# EAGLE design tube_power (EAGLE 6.6.0)
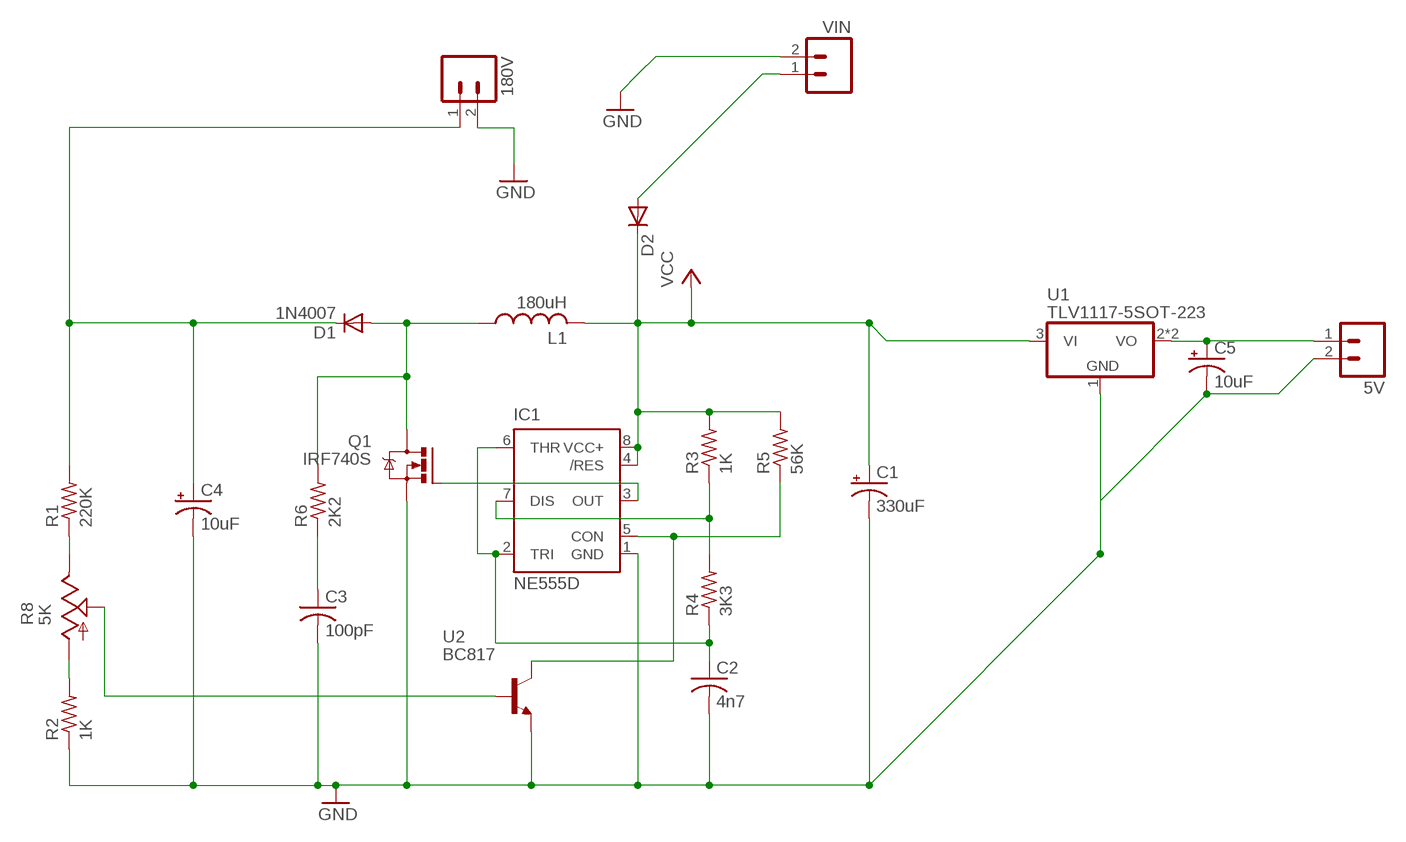
[diagram p0: schematic, sheet 1]

## Parts
5V  M023.5MM  [SCREWTERMINAL-3.5MM-2]
180V  M023.5MM  [SCREWTERMINAL-3.5MM-2]
C1  330uF  CAPACITOR_POLE5-10.5  [E5-10,5]
C2  4n7  CAPACITORC0805K  [C0805K]
C3  100pF  CAPACITORC0805K  [C0805K]
C4  10uF  CAPACITOR_POLE3.5-8  [E3,5-8]
C5  10uF  CAPACITOR_POLE2-5  [E2-5]
D1  1N4007  DIODESMA  [SMA-DIODE]
D2  DIODESOD-80  [SOD80C]
IC1  NE555D  [SO08]
L1  180uH  INDUCTOR  [RBL0712]
Q1  IRF740S  [TO263]
R1  220K  RESISTOR0207/10  [0207/10]
R2  1K  RESISTORR1206  [R1206]
R3  1K  RESISTORR0805  [R0805]
R4  3K3  RESISTORR0805  [R0805]
R5  56K  RESISTORR0805  [R0805]
R6  2K2  RESISTORR0805  [R0805]
R8  5K  TRIM_POTEVM2N  [TRIM-EVM2N]
U1  TLV1117-5SOT-223  [SOT-223]
U2  BC817  [SOT-23]
VIN  M023.5MM  [SCREWTERMINAL-3.5MM-2]

## Nets
5V [power]: 5V.1 C5.+ U1.2(VO) U1.4(VO)
180V [power]: 180V.1 C4.+ D1.C R1.2
CON: IC1.5(CON) R5.1 U2.3(C)
DIS: IC1.7(DIS) R3.1 R4.2
GND [ground]: 5V.2 180V.2 C1.- C2.2 C3.2 C4.- C5.- IC1.1(GND) Q1.2(S) R2.1 U1.1(GND) U2.2(E) VIN.2
L1: D1.A L1.P$1 Q1.3(D) R6.2
N$1: R8.P$2(S) U2.1(B)
N$2: D2.A VIN.1
N$3: R2.2 R8.P$1(A)
OUT: IC1.3(OUT) Q1.1(G)
R1: R1.1 R8.P$3(E)
R6: C3.1 R6.1
THR: C2.1 IC1.2(TRI) IC1.6(THR) R4.1
VCC: C1.+ D2.C IC1.4(/RES) IC1.8(VCC+) L1.P$2 R3.2 R5.2 U1.3(VI)

## Library data of the parts
5V 180V VIN = iStivi - Header-Connector:M02: Header 2 Standard 2-pin 0.1" header. Use with straight break away headers (SKU : PRT-00116), right angle break away headers (PRT-00553), swiss pins (PRT-00743), machine pins (PRT-00117), and female headers (PRT-00115). Molex polarized connector foot print use with SKU : PRT-08233 with associated crimp pins and housings.
C1 C4 C5 = iStivi - RCLD:CAPACITOR_POL: POLARIZED CAPACITOR, American symbol
C2 C3 = iStivi - RCLD:CAPACITOR: CAPACITOR, American symbol
D1 D2 = iStivi - RCLD:DIODE: Diode These are standard reverse protection diodes and small signal diodes.
IC1 = iStivi - ICs:NE555: Timer General purpose bipolar Timer
L1 = iStivi - RCLD:INDUCTOR: INDUCTOR
Q1 = iStivi - Transistor-FET-reg:IRF740: N-CHANNEL MOS FET 400V MOSFET
R1-R6 = iStivi - RCLD:RESISTOR: RESISTOR
R8 = iStivi - RCLD:TRIM_POT: POTENTIOMETER
U1 = iStivi - Transistor-FET-reg:TLV1117-5: Fixed 5V regulator SMD fixed 5V regulator TLV117-5
U2 = iStivi - Transistor-FET-reg:BC817: BC817 NPN Transistor NPN transistor

## Net classes
1 ground: width 0.356 mm
2 power: width 0.356 mm

## Board
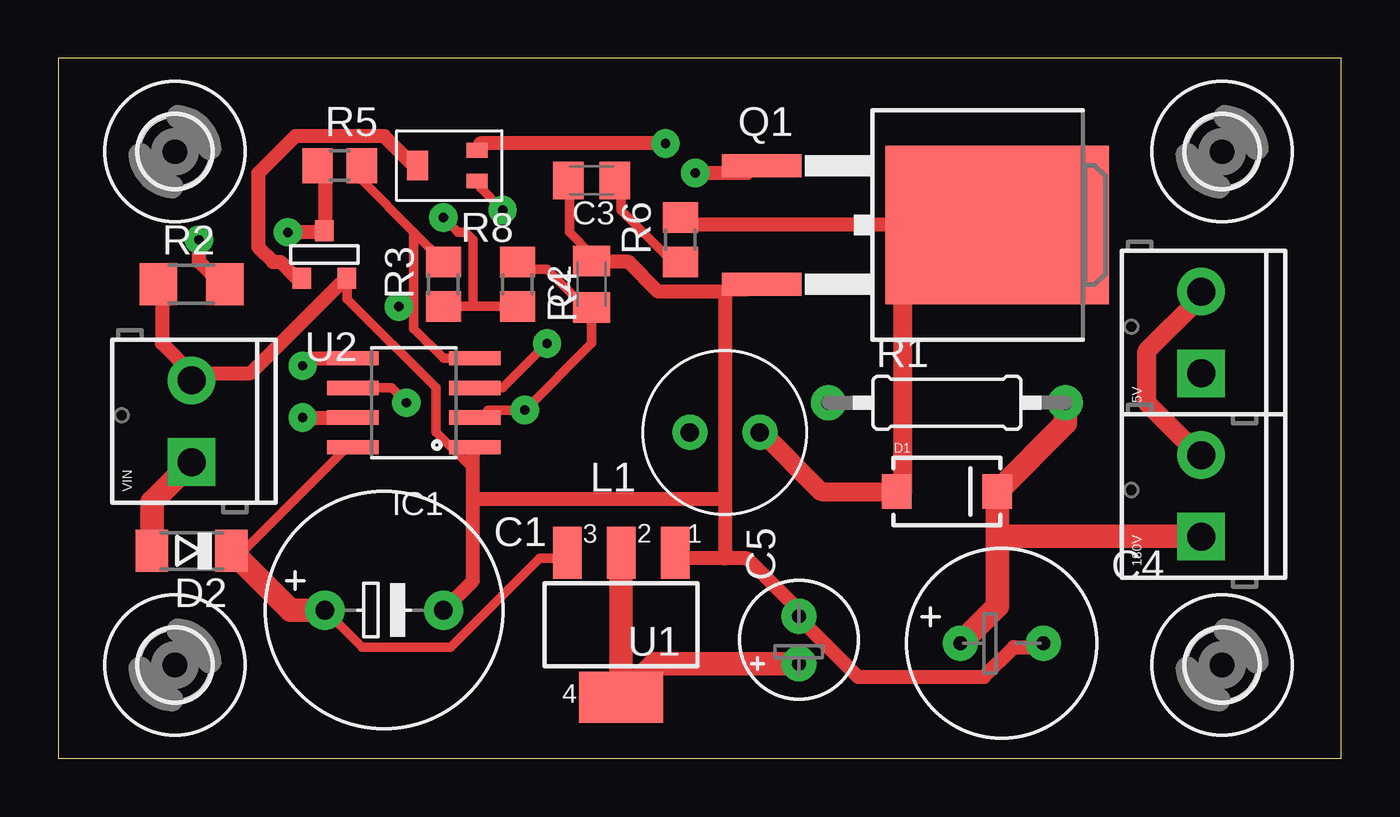
[diagram p1: board, top side]
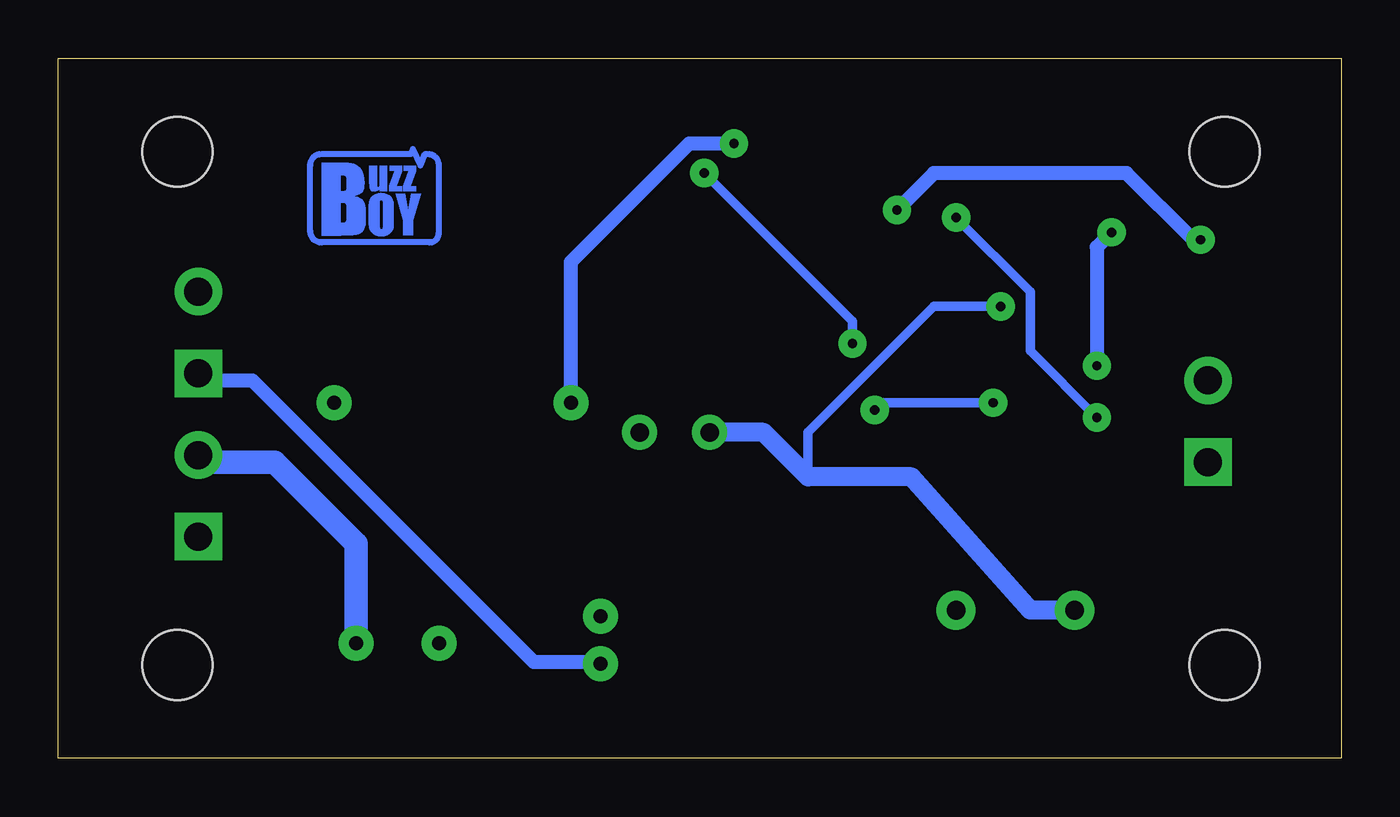
[diagram p2: board, bottom side, seen from below]

Size 55 x 30 mm. Coordinates in mm from the lower left corner, seen from the top.
Outline: 0,0 55,0 55,30 0,30 0,0
Copper layers (1*16): Top 0.035mm / dielectric 1.5mm / Bottom 0.035mm
Design rules "iStivi-0.8mm via-12mil-track *": minimum track width 16mil, minimum drill 0.4mm, track to track 12mil, track to pad 12mil, pad to pad 10mil, via to via 16mil, smd to smd 10mil, copper to edge 40mil, drill to drill 8mil, minimum pad ring 10mil, minimum via ring 16mil, stop-mask expansion 0mil, vias tented up to drill 0.4mm, thermal gap 12mil

### Footprints (pad centres in the part's own frame; a part is rotated, then mirrored left to right if it is on the bottom)
SCREWTERMINAL-3.5MM-2 = drill 1.2 pad 2.032 square: 1 0,0 | drill 1.2 pad 2.032: 2 3.5,0
E5-10,5 = drill 0.8 pad 1.676: + -2.54,0; - 2.54,0
C0805K = smd 1.3 x 1.6: 1 -1,0; 2 1,0
E3,5-8 = drill 0.6 pad 1.5: + -1.778,0; - 1.778,0
E2-5 = drill 0.6 pad 1.5: + -1.016,0; - 1.016,0
SMA-DIODE = smd 1.27 x 1.47: A -2.15,0; C 2.15,0
SOD80C = smd 1.4 x 1.8: A 1.7,0; C -1.7,0
SO08 = smd 0.61 x 2.21: 1 -1.905,-2.616; 2 -0.635,-2.616; 3 0.635,-2.616; 4 1.905,-2.616; 5 1.905,2.616; 6 0.635,2.616; 7 -0.635,2.616; 8 -1.905,2.616
RBL0712 = drill 0.8 pad 1.5: P$1 -1.5,0; P$2 1.5,0
TO263 = smd 1 x 3.4: 1 -2.54,-6.6; 2 2.54,-6.6 | smd 6.8 x 9.6: 3 0,3.5
0207/10 = drill 0.6 pad 1.5: 1 -5.08,0; 2 5.08,0
R1206 = smd 1.6 x 1.803: 1 -1.422,0; 2 1.422,0
R0805 = smd 1.3 x 1.5: 1 -0.95,0; 2 0.95,0
TRIM-EVM2N = smd 0.635 x 0.9: P$1 -0.66,-1.45; P$3 0.66,-1.45 | smd 1.27 x 0.9: P$2 0,1.1
SOT-223 = smd 1.219 x 2.235: 1 -2.311,-3.099; 2 0,-3.099; 3 2.311,-3.099 | smd 3.6 x 2.2: 4 0,3.099
SOT-23 = smd 0.787 x 0.889: 1 0.991,1.016; 2 -0.94,1.016; 3 0.025,-1.016
3,0-SMALL = hole 3: 0,0

### Placement (x,y rotation side)
5V  49,16.5 90 top
180V  49,9.5 90 top
C1  13.97,6.35 0 top
C2  22.86,20.32 90 top
C3  22.86,24.77 180 top
C4  40.44,4.93 0 top
C5  31.75,5.08 90 top
D1  38.1,11.43 0 top
D2  5.71,8.89 180 top
IC1  15.24,15.24 90 top
L1  28.57,13.97 180 top
Q1  36.75,22.86 270 top
R1  38.1,15.24 0 top
R2  5.71,20.32 0 top
R3  16.51,20.32 90 top
R4  19.68,20.32 270 top
R5  12.06,25.4 0 top
R6  26.67,22.23 90 top
R8  16.51,25.4 90 top
U1  24.13,5.71 180 top
U2  11.43,21.59 180 top
U$1  [3,0-SMALL]  5,26 0 top
U$2  [3,0-SMALL]  5,4 0 top
U$3  [BUZZBOY-SILK]  21.59,13.97 90 top
U$4  [3,0-SMALL]  49.89,4 0 top
U$5  [3,0-SMALL]  49.89,26 0 top
U$6  [BUZZBOY]  44.37,21.91 0 bottom
VIN  5.71,12.7 90 top

### Tracks (layer width: path | path; a pad name or v marks a point on that pad's centre or on a via)
5V
  Top 1.016: U1.2 U1.4 25.58,4.06 C5.+
  Bottom 0.406: 32.38,4.13 C5.+
  Bottom 0.61: 32.38,4.13 34.61,4.13 46.67,16.19 48.9,16.19 5V.1
180V
  Top 1.016: C4.+ 40.25,6.51 40.25,9.53 | 40.25,9.53 D1.C 43.18,14.36 R1.2 | 180V.1 48.98,9.53 40.25,9.53
CON  (via drill 0.4)
  Top 0.406: 11.43,22.86 U2.3 11.11,22.54 | 11.43,25.4 R5.1 | v10.48,16.83 10.79,17.14
  Top 0.61: 11.43,25.4 11.43,22.86 | 10.79,17.14 IC1.5 | 11.11,22.54 v9.84,22.54
  Bottom 0.61: v10.48,16.83 10.48,21.91 v9.84,22.54
DIS  (via drill 0.4)
  Top 0.406: 17.78,19.37 R4.2 | 17.78,19.37 R3.1 | v16.51,23.18 17.14,22.54 17.46,22.54 17.78,22.23 17.78,19.37
  Top 0.61: v10.48,14.61 IC1.7
  Bottom 0.406: v10.48,14.61 13.34,17.46 13.34,20 v16.51,23.18
GND
  Top 0.406: 12.06,20.32 U2.2 12.38,20.32 12.38,19.68 16.19,15.88 16.19,13.97 17.78,12.38 | 5.71,16.51 VIN.2 | 4.45,20.32 R2.1 | 17.78,13.34 IC1.1 | 48.9,13.02 180V.2 | 26.67,8.57 U1.1 | 31.75,6.35 C5.- 31.75,6.03 | C3.2 21.91,24.77 21.91,22.54 22.86,21.59 C2.2 22.86,21.27 | 29.53,20 28.57,20 Q1.2 29.84,20.32 29.53,20
  Top 0.61: 12.06,20.32 8.26,16.51 5.71,16.51 4.45,17.78 4.45,20.32 | 17.78,11.11 17.78,7.62 C1.- | 17.78,11.11 17.78,12.38 17.78,13.34 | 28.57,8.57 29.53,8.57 31.75,6.35 | 28.57,8.57 26.67,8.57 | 22.86,21.27 24.45,21.27 25.72,20 28.57,20 28.57,11.11 | 28.57,11.11 28.57,8.57 | 31.75,6.03 34.29,3.49 39.69,3.49 40.96,4.76 41.91,4.76 C4.- | 28.57,11.11 17.78,11.11
  Top 0.813: 48.9,13.02 46.67,15.24 46.67,17.46 48.9,19.68 5V.2
  Bottom 1.016: C4.- 42.22,9.2 45.72,12.7 48.7,12.7 180V.2
L1
  Top 0.406: 30.16,13.97 L1.P$1 | Q1.3 36.2,22.86 | 26.67,22.86 R6.2 | 36.2,11.43 D1.A
  Top 0.61: 36.2,22.86 26.67,22.86
  Top 0.813: D1.A 32.7,11.43 30.16,13.97 | 36.2,22.86 36.2,11.43
N$1
  Top 0.406: 10.16,20.64 U2.1 | 15.24,25.4 R8.P$2
  Top 0.61: 10.16,20.64 9.53,21.27 9.21,21.27 8.57,21.91 8.57,25.08 10.16,26.67 13.97,26.67 15.24,25.4
N$2
  Top 1.016: VIN.1 4.01,11 D2.A
N$3  (via drill 0.4)
  Top 0.406: v19.05,23.5 18.1,24.45 R8.P$1 | 6.99,20.32 R2.2
  Top 0.61: v6.03,22.23 6.03,21.27 6.99,20.32
  Bottom 0.406: v6.03,22.23 6.35,22.23
  Bottom 0.61: v19.05,23.5 17.46,25.08 9.21,25.08 6.35,22.23
OUT  (via drill 0.4)
  Top 0.406: IC1.3 19.05,15.88 v20.95,17.78 | 29.53,25.08 29.84,25.4 Q1.1
  Top 0.61: 29.53,25.08 v27.3,25.08
  Bottom 0.406: v20.95,17.78 20.95,18.73 v27.3,25.08
R1  (via drill 0.4)
  Top 0.61: v26.04,26.35 18.1,26.35 R8.P$3
  Bottom 0.61: v26.04,26.35 27.94,26.35 33.02,21.27 R1.1
R6
  Top 0.406: R6.1 26.67,21.59 26.04,21.59 24.13,23.5 24.13,24.77 C3.1
THR  (via drill 0.4)
  Top 0.406: 22.86,19.05 20.95,20.95 19.68,20.95 R4.1 | IC1.6 14.29,15.88 v14.92,15.24 | IC1.2 18.1,14.61 18.41,14.92 v20,14.92 22.86,17.78 22.86,19.05 | 22.86,19.05 C2.1
  Bottom 0.406: v14.92,15.24 19.68,15.24 v20,14.92
VCC  (via drill 0.4)
  Top 0.406: 15.24,22.54 R3.2 | 15.24,22.54 13.02,24.77 R5.2 | IC1.4 16.51,17.14 15.24,18.41 15.24,19.37 | 15.24,22.54 15.24,19.37 | IC1.8 12.38,13.34 7.94,8.89 D2.C | C1.+ 13.02,4.76 16.83,4.76 20.64,8.57 21.59,8.57 U1.3 | v14.61,19.37 15.24,19.37
  Top 1.016: D2.C 9.96,6.35 C1.+
  Bottom 0.406: v14.61,19.37 17.46,19.37 22.86,13.97 22.86,12.06
  Bottom 0.813: L1.P$2 24.77,13.97 22.86,12.06 18.41,12.06 13.34,6.35 C1.+

### Text on the board
Document: TUBE POWER SUPPLY | GND | 5V | GND | GND | VIN | HV | 3 | 2 | 1 | D2 | 4
_tplace: TUBE POWER SUPPLY | GND | 5V | GND | GND | VIN | HV | 3 | 2 | 1 | 4